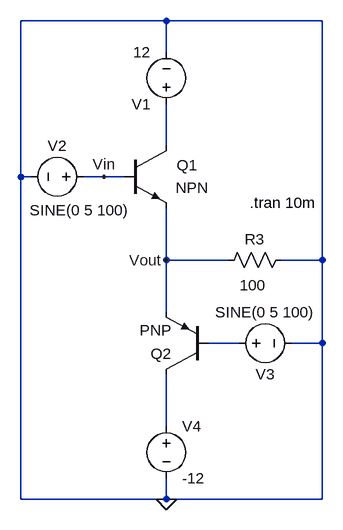
[diagram p0: schematic class B - push pull.asc]
class B - push pull.asc, the LTspice schematic file:
Version 4
SHEET 1 880 680
WIRE 208 -80 -16 -80
WIRE 448 -80 208 -80
WIRE 208 -32 208 -80
WIRE 208 112 208 48
WIRE -16 160 -16 -80
WIRE 0 160 -16 160
WIRE 112 160 80 160
WIRE 144 160 112 160
WIRE 208 288 208 208
WIRE 304 288 208 288
WIRE 448 288 448 -80
WIRE 448 288 384 288
WIRE 208 368 208 288
WIRE 320 416 272 416
WIRE 448 416 448 288
WIRE 448 416 400 416
WIRE 208 544 208 464
WIRE -16 656 -16 160
WIRE 208 656 208 624
WIRE 208 656 -16 656
WIRE 448 656 448 416
WIRE 448 656 208 656
FLAG 208 656 0
FLAG 112 160 Vin
FLAG 208 288 Vout
SYMBOL npn 144 112 R0
WINDOW 0 80 30 Left 2
WINDOW 3 78 65 Left 2
SYMATTR InstName Q1
SYMBOL voltage 208 64 R180
WINDOW 123 0 0 Left 0
WINDOW 39 0 0 Left 0
SYMATTR InstName V1
SYMATTR Value 12
SYMBOL voltage 96 160 R90
WINDOW 0 -32 56 VBottom 2
WINDOW 3 36 22 VTop 2
WINDOW 123 0 0 Left 0
WINDOW 39 0 0 Left 0
SYMATTR InstName V2
SYMATTR Value SINE(0 5 100)
SYMBOL res 400 272 R90
WINDOW 0 0 56 VBottom 2
WINDOW 3 39 59 VTop 2
SYMATTR InstName R3
SYMATTR Value 100
SYMBOL voltage 304 416 R270
WINDOW 0 -32 56 VBottom 2
WINDOW 3 32 56 VTop 2
WINDOW 123 0 0 Left 0
WINDOW 39 0 0 Left 0
SYMATTR InstName V3
SYMATTR Value SINE(0 5 100)
SYMBOL voltage 208 528 R0
WINDOW 123 0 0 Left 0
WINDOW 39 0 0 Left 0
SYMATTR InstName V4
SYMATTR Value -12
SYMBOL pnp 272 464 R180
SYMATTR InstName Q2
TEXT 336 200 Left 2 !.tran 10m

The netlist it stands for:
* class B - push pull.asc
Q1 N001 Vin Vout 0 NPN
V1 N001 0 12
V2 Vin 0 SINE(0 5 100)
R3 0 Vout 100
V3 N002 0 SINE(0 5 100)
V4 N003 0 -12
Q2 N003 N002 Vout 0 PNP
.model NPN NPN
.model PNP PNP
.lib standard.bjt
.tran 10m
.backanno
.end